# Altium project PCB_Baitaplon.PrjPcb
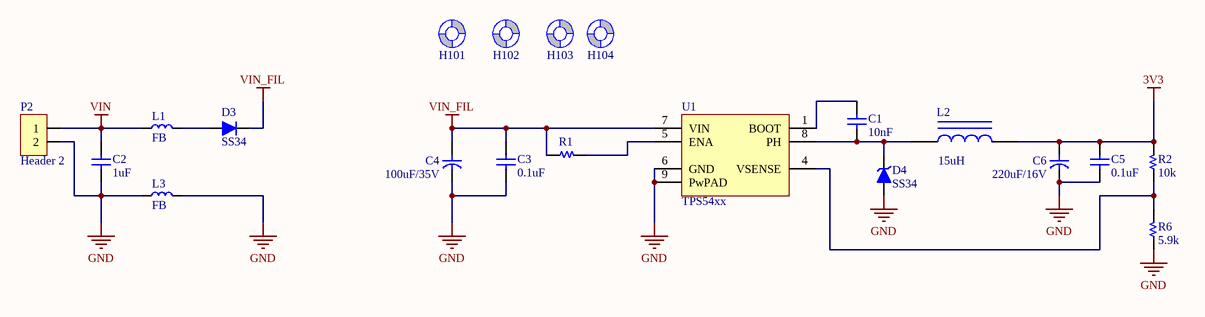
[diagram p0: SCH_3.3v_regulator.SchDoc]
6 sheets, 63 parts. Net scope: global (net labels, ports and power ports of the same name join across sheets).
Board file: PCB_final.PcbDoc
Sheets:
  SCH_3.3v_regulator.SchDoc
  SCH_esp32.SchDoc
  SCH_switches.SchDoc
  SCH_sensor.SchDoc
  SCH_RS-485.SchDoc
  SCH_LEDS.SchDoc

## Sheet SCH_3.3v_regulator.SchDoc
size A; SheetNumber: 1; SheetTotal: 6

### Parts
C1  10nF  [C 0805]
C2  1uF  [C 0805]
C3  0.1uF  [C 0805]
C4  100uF/35V  [C SMD ALU (D8)]
C5  0.1uF  [C 0805]
C6  220uF/16V  [C SMD ALU (D8)]
D3  SS34  [Diode PowerDI123]
D4  SS34  [DO-214AC (SMA)]
H101  Screw Hole  [SCREW/3.2/7.0/M]  (value not drawn)  (no BOM)
H102  Screw Hole  [SCREW/3.2/7.0/M]  (value not drawn)  (no BOM)
H103  Screw Hole  [SCREW/3.2/7.0/M]  (value not drawn)  (no BOM)
H104  Screw Hole  [SCREW/3.2/7.0/M]  (value not drawn)  (no BOM)
L1  FB  [L 0805 (2012)]
L2  15uH  [AXIAL-0.9]
L3  FB  [L 0805 (2012)]
P2  Header 2  [HDR/Header/2/BOX]
R1  R  [R 0805]  (value not drawn)
R2  10k  [R 0805]
R6  5.9k  [R 0805]
U1  TPS54xx  [SOIC-8 EP]

### Nets
3V3: C5.1 C6.1 L2.2 R2.2
GND: C2.2 C3.2 C4.2 C5.2 C6.2 D4.1(A) L3.1 L3.2 P2.2 R6.1 U1.6(GND) U1.9(PwPAD)
VIN: C2.1 L1.1 P2.1
VIN_FIL: C3.1 C4.1 D3.2(K) R1.1 U1.7(VIN)
NetC1_1: C1.1 U1.1(BOOT)
NetC1_2: C1.2 D4.2(K) L2.1 U1.8(PH)
NetD3_1: D3.1(A) L1.2
NetR1_2: R1.2 U1.5(ENA)
NetR2_1: R2.1 R6.2 U1.4(VSENSE)

Not connected (* = marked no-connect by the designer): H101 1(Screw); H102 1(Screw); H103 1(Screw); H104 1(Screw)

### Library data of the parts
C1-C3 C5 = Capacitor NP: Capacitor non-pol
C4 C6 = Capacitor: Capacitor pol
D3 = Diode: Default Diode
D4 = Diode Zener: Zener Diode
L1 L3 = Inductor
L2 = Inductor Iron: Magnetic-Core Inductor; Published: 24-Mar-1999; LatestRevisionDate: 17-Jul-2002; LatestRevisionNote: Re-released for DXP Platform.; PackageReference: AXIAL-0.9; Publisher: Altium Limited; PackageDescription: Axial Device, Thru-Hole; 2 Leads; 0.9 in Pin Spacing; Value: 15uH
P2 = Header 2: Header, 2-Pin
R1 R2 R6 = Resistor
U1 = TPS54xx: 3/5A, Wide input range, Step-down SWIFT DC-DC Converter
H101-H104 = Screw Hole: TYPE: NO-BOM; UNIT PRICE: 0

## Sheet SCH_esp32.SchDoc
size A; SheetNumber: 2; SheetTotal: 6
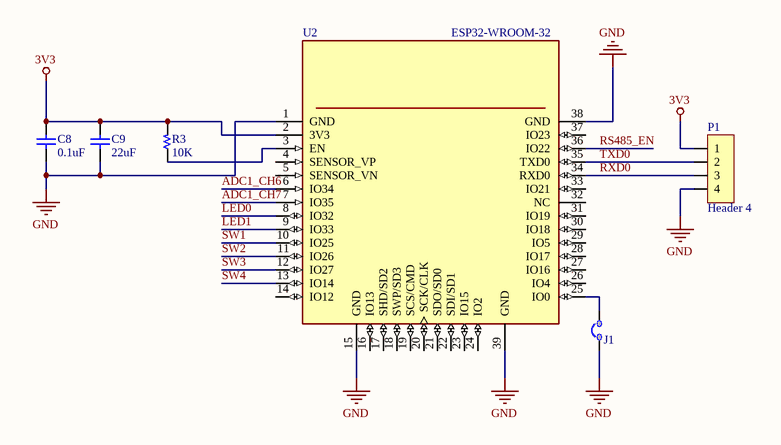
[diagram p1: SCH_esp32.SchDoc]

### Parts
C8  0.1uF  [C 0805]
C9  22uF  [C 0805]
J1  JUMP 2  [JUMP/2/Close]  (value not drawn)  (no BOM)
P1  Header 4  [HDR/Header/4]
R3  10K  [R 0805]
U2  ESP32-WROOM-32  [MODULE_ESP32-WROOM-32]

### Nets
3V3: C8.1 C9.1 P1.1 R3.2 U2.2(3V3)
GND: C8.2 C9.2 J1.1 P1.4 U2.1(GND) U2.15(GND) U2.38(GND) U2.39(GND)
ADC1_CH6: U2.6(IO34)
ADC1_CH7: U2.7(IO35)  [project net 3V3/2]
LED0: U2.8(IO32)
LED1: U2.9(IO33)
RS485_EN: U2.36(IO22)
RXD0: P1.3 U2.34(RXD0)
SW1: U2.10(IO25)
SW2: U2.11(IO26)
SW3: U2.12(IO27)
SW4: U2.13(IO14)
TXD0: P1.2 U2.35(TXD0)
NetJ1_2: J1.2 U2.25(IO0)
NetR3_1: R3.1 U2.3(EN)

Not connected (* = marked no-connect by the designer): U2 4(SENSOR_VP) 5(SENSOR_VN) 14(IO12) 16(IO13) 17(SHD/SD2) 18(SWP/SD3) 19(SCS/CMD) 20(SCK/CLK) 21(SDO/SD0) 22(SDI/SD1) 23(IO15) 24(IO2) 26(IO4) 27(IO16) 28(IO17) 29(IO5) 30(IO18) 31(IO19) 32(NC) 33(IO21) 37(IO23)

### Library data of the parts
C8 C9 = Capacitor NP: Capacitor non-pol
P1 = Header 4: Header, 4-Pin
R3 = Resistor
U2 = ESP32-WROOM-32: Bluetooth, WiFi 802.11b/g/n, Bluetooth v4.2 + EDR, Class 1, 2 and 3 Transceiver Module 2.4GHz ~ 2.5GHz Integrated, Trace Surface Mount; MF: Espressif Systems; MP: ESP32-WROOM-32D; Price: None; Package: Module Espressif Systems; Availability: Unavailable; SnapEDA_Link: https://www.snapeda.com/parts/ESP32-WROOM-32D/Espressif%20Systems/view-part/2768115/?ref=snap; Value: *

## Sheet SCH_switches.SchDoc
size A; SheetNumber: 3; SheetTotal: 3
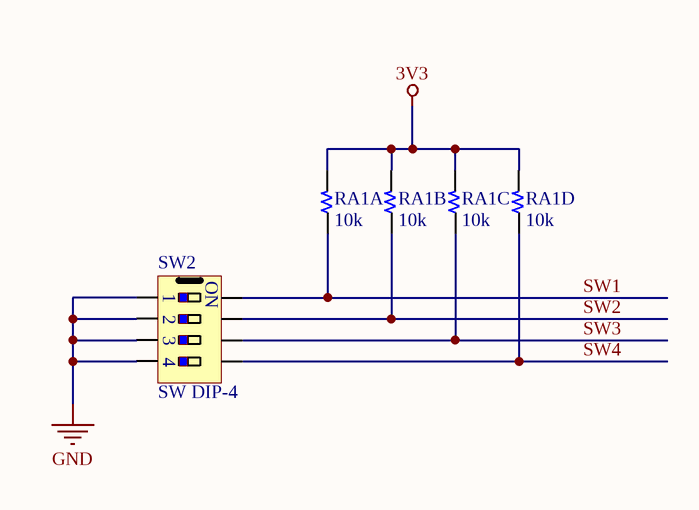
[diagram p2: SCH_switches.SchDoc]

### Parts
RA1A  10k  [R 0805]
RA1B  10k  [R 0805]
RA1C  10k  [R 0805]
RA1D  10k  [R 0805]
SW2  SW DIP-4  [SW/DIP4]

### Nets
3V3: RA1A.2 RA1B.2 RA1C.2 RA1D.2
GND: SW2.1 SW2.2 SW2.3 SW2.4
SW1: RA1A.1 SW2.8
SW2: RA1B.1 SW2.7
SW3: RA1C.1 SW2.6
SW4: RA1D.1 SW2.5

### Notes on the sheet
- (in symbol SW DIP-4) ON

### Library data of the parts
RA1A RA1B RA1C RA1D = Resistor

## Sheet SCH_sensor.SchDoc
size A; SheetNumber: 4; SheetTotal: 4
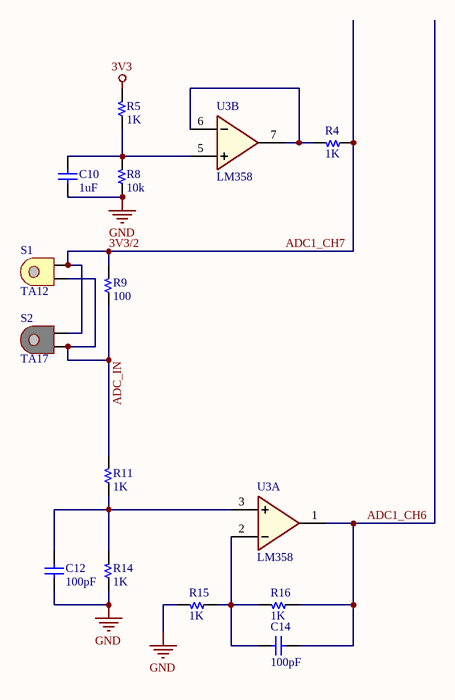
[diagram p3: SCH_sensor.SchDoc]

### Parts
C10  1uF  [C 0805]
C12  100pF  [C 0805]
C14  100pF  [C 0805]
R4  1K  [R 0805]
R5  1K  [R 0805]
R8  10k  [R 0805]
R9  100  [R 0805]
R11  1K  [R 0805]
R14  1K  [R 0805]
R15  1K  [R 0805]
R16  1K  [R 0805]
S1  TA12  [TA12]
S2  TA17  [TA17]
U3  LM358  [SOIC-8]  (parts A,B of 2)

### Nets
3V3: R5.2
GND: C10.2 C12.2 R8.1 R14.1 R15.2 U3.4(GND)
VCC: U3.8(VCC)
3V3/2: R4.1 R9.2 S1.2 S2.2  [also labelled ADC1_CH7]
ADC1_CH6: C14.2 R16.1 U3.1(OutA)
ADC_IN: R9.1 R11.2 S1.1 S2.1
NetC10_1: C10.1 R5.1 R8.2 U3.5(B+)
NetC12_1: C12.1 R11.1 R14.2 U3.3(A+)
NetC14_1: C14.1 R15.1 R16.2 U3.2(A-)
NetR4_2: R4.2 U3.6(B-) U3.7(OutB)

### Library data of the parts
C10 C12 C14 = Capacitor NP: Capacitor non-pol
R4 R5 R8 R9 R11 R14-R16 = Resistor
U3 = LM358: Low Power Dual Operational Amplifiers

## Sheet SCH_RS-485.SchDoc
size A; SheetNumber: 5; SheetTotal: 5
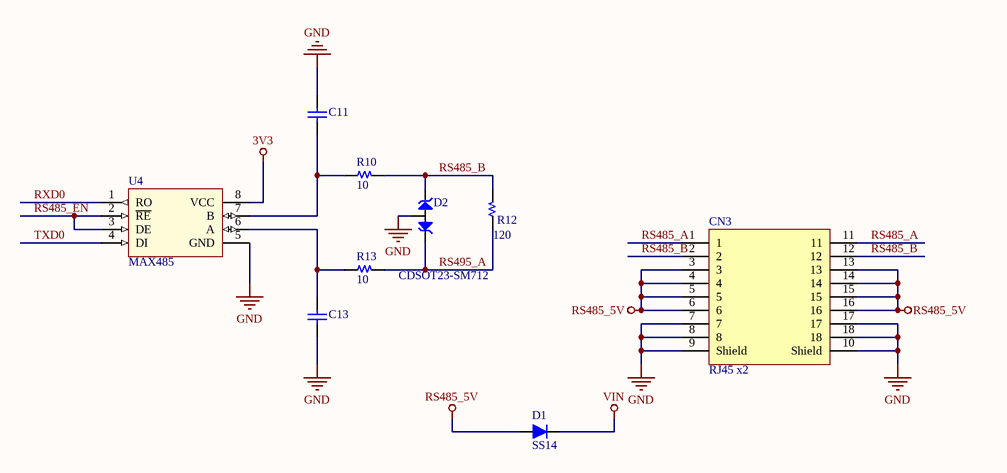
[diagram p4: SCH_RS-485.SchDoc]

### Parts
C11  10nF  [C 0805]  (value not drawn)
C13  10nF  [C 0805]  (value not drawn)
CN3  RJ45 x2  [CONN/RJ45/x2]
D1  SS14  [DO-214AC (SMA)]
D2  CDSOT23-SM712  [SOT-23]
R10  10  [R 0805]
R12  120  [R 0805]
R13  10  [R 0805]
U4  MAX485  [SOIC-8]

### Nets
3V3: U4.8(VCC)
GND: C11.1 C13.2 CN3.7 CN3.8 CN3.9(Shield) CN3.10(Shield) CN3.17 CN3.18 D2.3(COM) U4.5(GND)
RS485_5V: CN3.3 CN3.4 CN3.5 CN3.6 CN3.13 CN3.14 CN3.15 CN3.16 D1.1(A)
VIN: D1.2(K)
RS485_A: CN3.1 CN3.11
RS485_B: CN3.2 CN3.12 D2.2(IO2) R10.2 R12.2
RS485_EN: U4.2(~{RE}) U4.3(DE)
RS495_A: D2.1(IO1) R12.1 R13.2
RXD0: U4.1(RO)
TXD0: U4.4(DI)
NetC11_2: C11.2 R10.1 U4.7(B)
NetC13_1: C13.1 R13.1 U4.6(A)

### Library data of the parts
C11 C13 = Capacitor NP: Capacitor non-pol
CN3 = CON RJ45 x2: Connector RJ45 X2
D1 = Diode: Default Diode
D2 = CDSOT23-SM712: TVS DIODE 7V/12V 14V/26V SOT23-3
R10 R12 R13 = Resistor
U4 = MAX485: Low-Power, Slew-Rate-Limited  RS-485/RS-422 Transceivers

## Sheet SCH_LEDS.SchDoc
size A; SheetNumber: 6; SheetTotal: 6
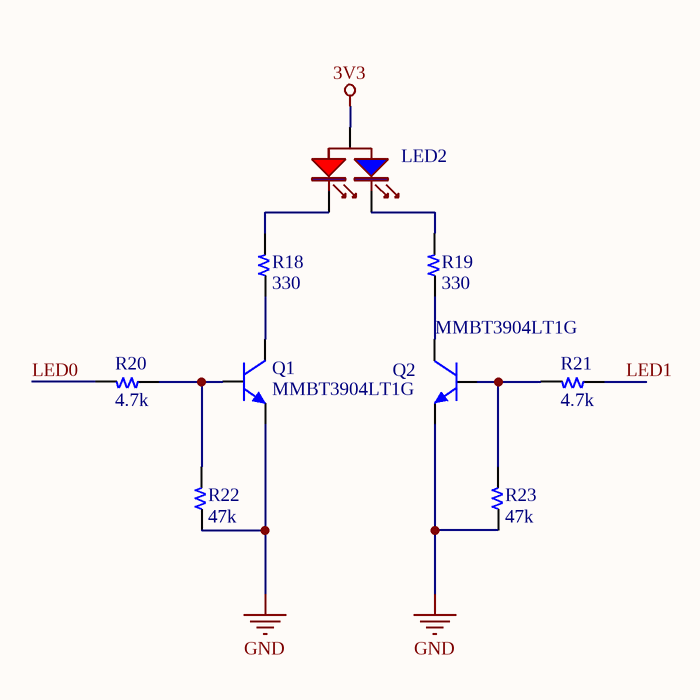
[diagram p5: SCH_LEDS.SchDoc]

### Parts
LED2  RB LED  [LED-BICOLOR-3MM]  (value not drawn)
Q1  MMBT3904LT1G  [SOT-23]
Q2  MMBT3904LT1G  [SOT-23]
R18  330  [R 0603]
R19  330  [R 0603]
R20  4.7k  [R 0603]
R21  4.7k  [R 0603]
R22  47k  [R 0603]
R23  47k  [R 0603]

### Nets
3V3: LED2.2(A)
GND: Q1.2(E) Q2.2(E) R22.1 R23.1
LED0: R20.2
LED1: R21.1
NetLED2_1: LED2.1(K1) R18.2
NetLED2_3: LED2.3(K2) R19.2
NetQ1_1: Q1.1(B) R20.1 R22.2
NetQ1_3: Q1.3(C) R18.1
NetQ2_1: Q2.1(B) R21.2 R23.2
NetQ2_3: Q2.3(C) R19.1

### Library data of the parts
LED2 = LED 2-color-A: Bicolor RB 3mm LED
Q1 Q2 = Transistor NPN: NPN Bipolar Transistor
R18-R23 = Resistor

## Nets that join several sheets
3V3: SCH_3.3v_regulator (C5.1 C6.1 L2.2 R2.2), SCH_esp32 (5 pins), SCH_switches (RA1A.2 RA1B.2 RA1C.2 RA1D.2), SCH_sensor (R5.2), SCH_RS-485 (U4.8), SCH_LEDS (LED2.2)
GND: SCH_3.3v_regulator (12 pins), SCH_esp32 (8 pins), SCH_switches (SW2.1 SW2.2 SW2.3 SW2.4), SCH_sensor (6 pins), SCH_RS-485 (10 pins), SCH_LEDS (Q1.2 Q2.2 R22.1 R23.1)
VIN: SCH_3.3v_regulator (C2.1 L1.1 P2.1), SCH_RS-485 (D1.2)
3V3/2: SCH_esp32 (U2.7), SCH_sensor (R4.1 R9.2 S1.2 S2.2)
ADC1_CH6: SCH_esp32 (U2.6), SCH_sensor (C14.2 R16.1 U3.1)
LED0: SCH_esp32 (U2.8), SCH_LEDS (R20.2)
LED1: SCH_esp32 (U2.9), SCH_LEDS (R21.1)
RS485_EN: SCH_esp32 (U2.36), SCH_RS-485 (U4.2 U4.3)
RXD0: SCH_esp32 (P1.3 U2.34), SCH_RS-485 (U4.1)
SW1: SCH_esp32 (U2.10), SCH_switches (RA1A.1 SW2.8)
SW2: SCH_esp32 (U2.11), SCH_switches (RA1B.1 SW2.7)
SW3: SCH_esp32 (U2.12), SCH_switches (RA1C.1 SW2.6)
SW4: SCH_esp32 (U2.13), SCH_switches (RA1D.1 SW2.5)
TXD0: SCH_esp32 (P1.2 U2.35), SCH_RS-485 (U4.4)